# EAGLE board main (EAGLE 9.6.2), part 1 of 2
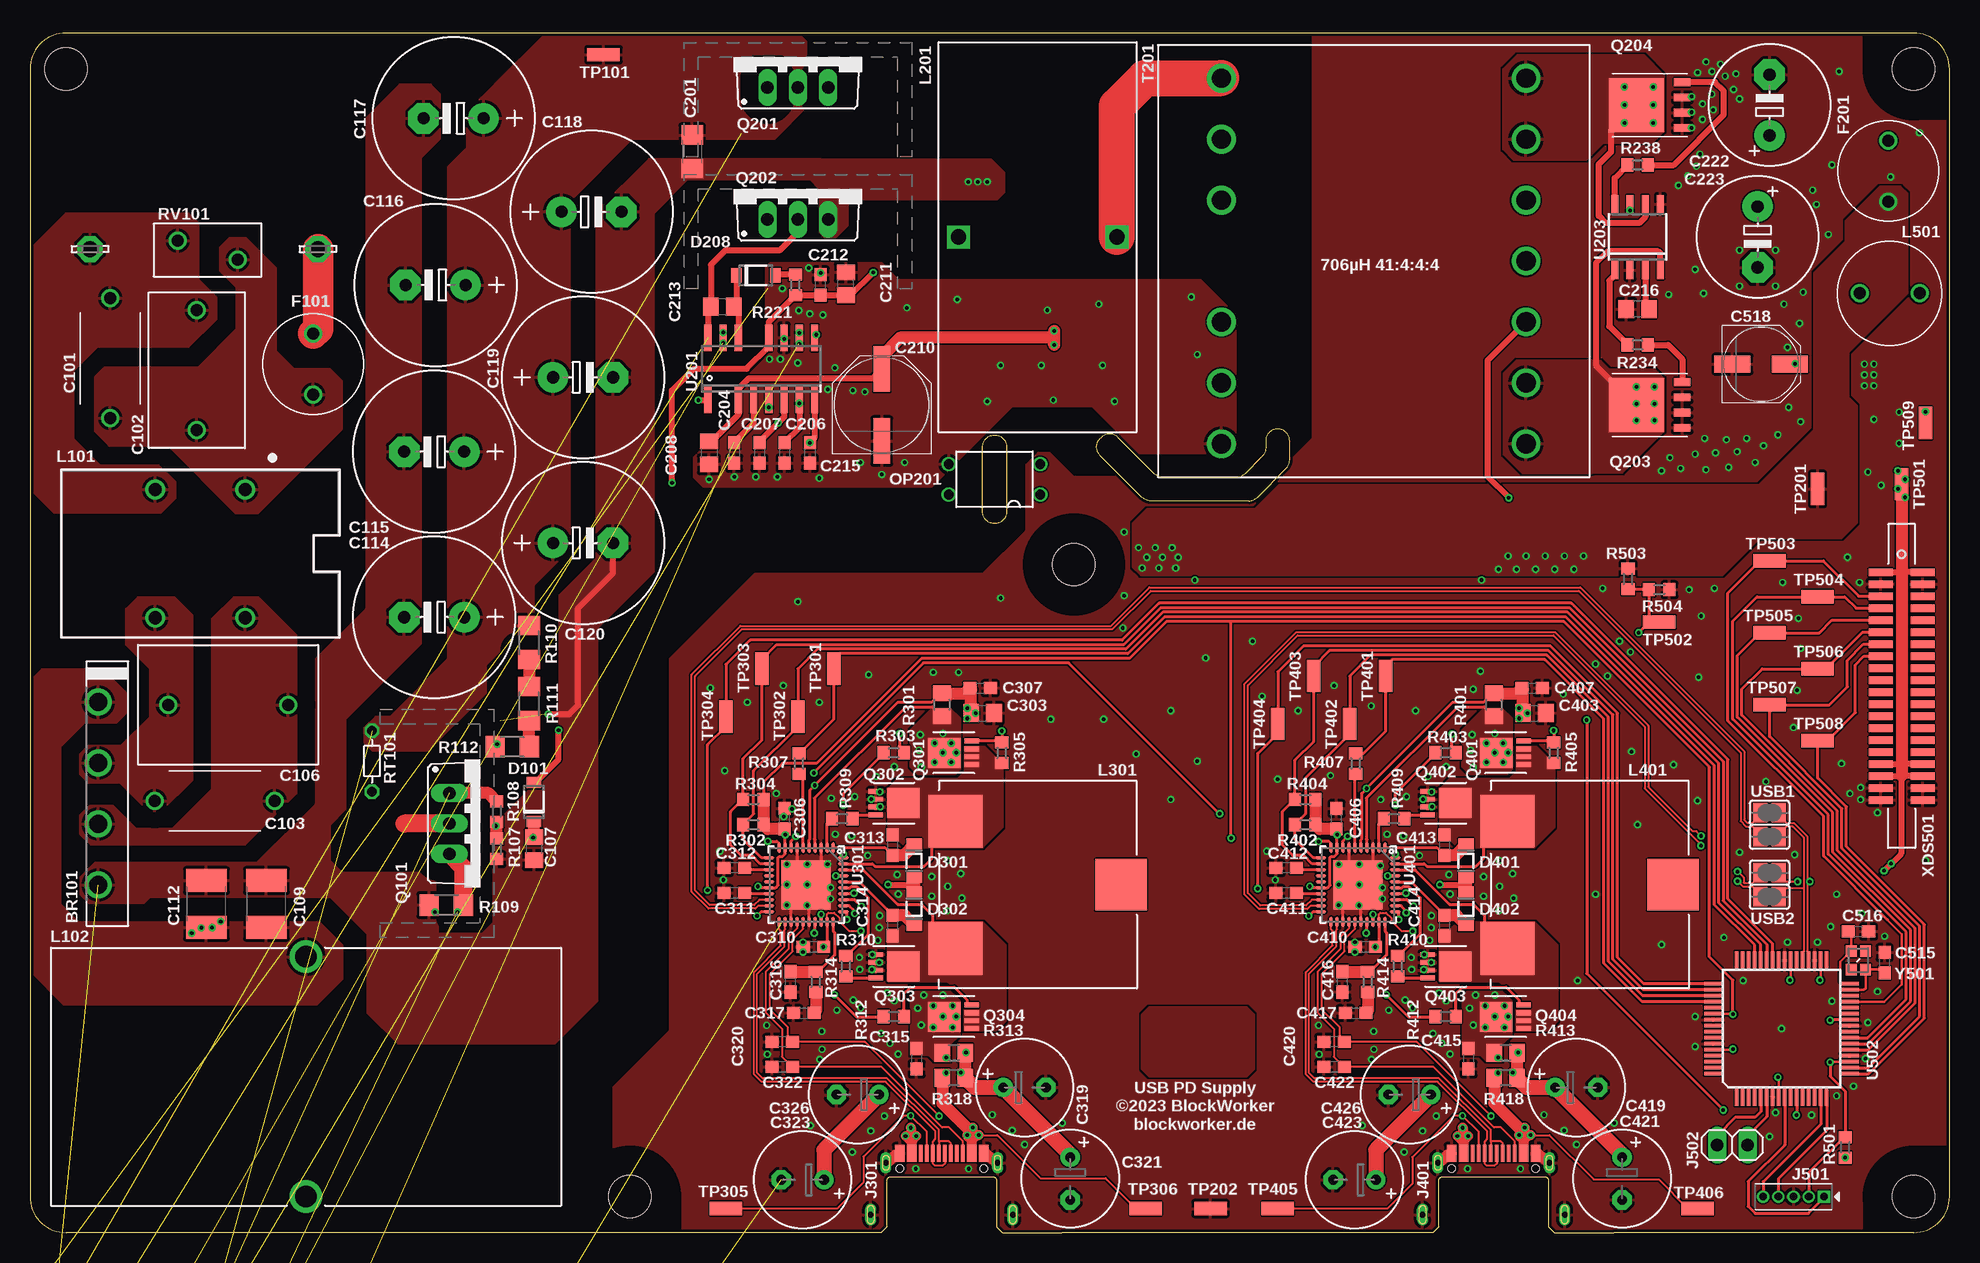
[diagram p5: board, top side]
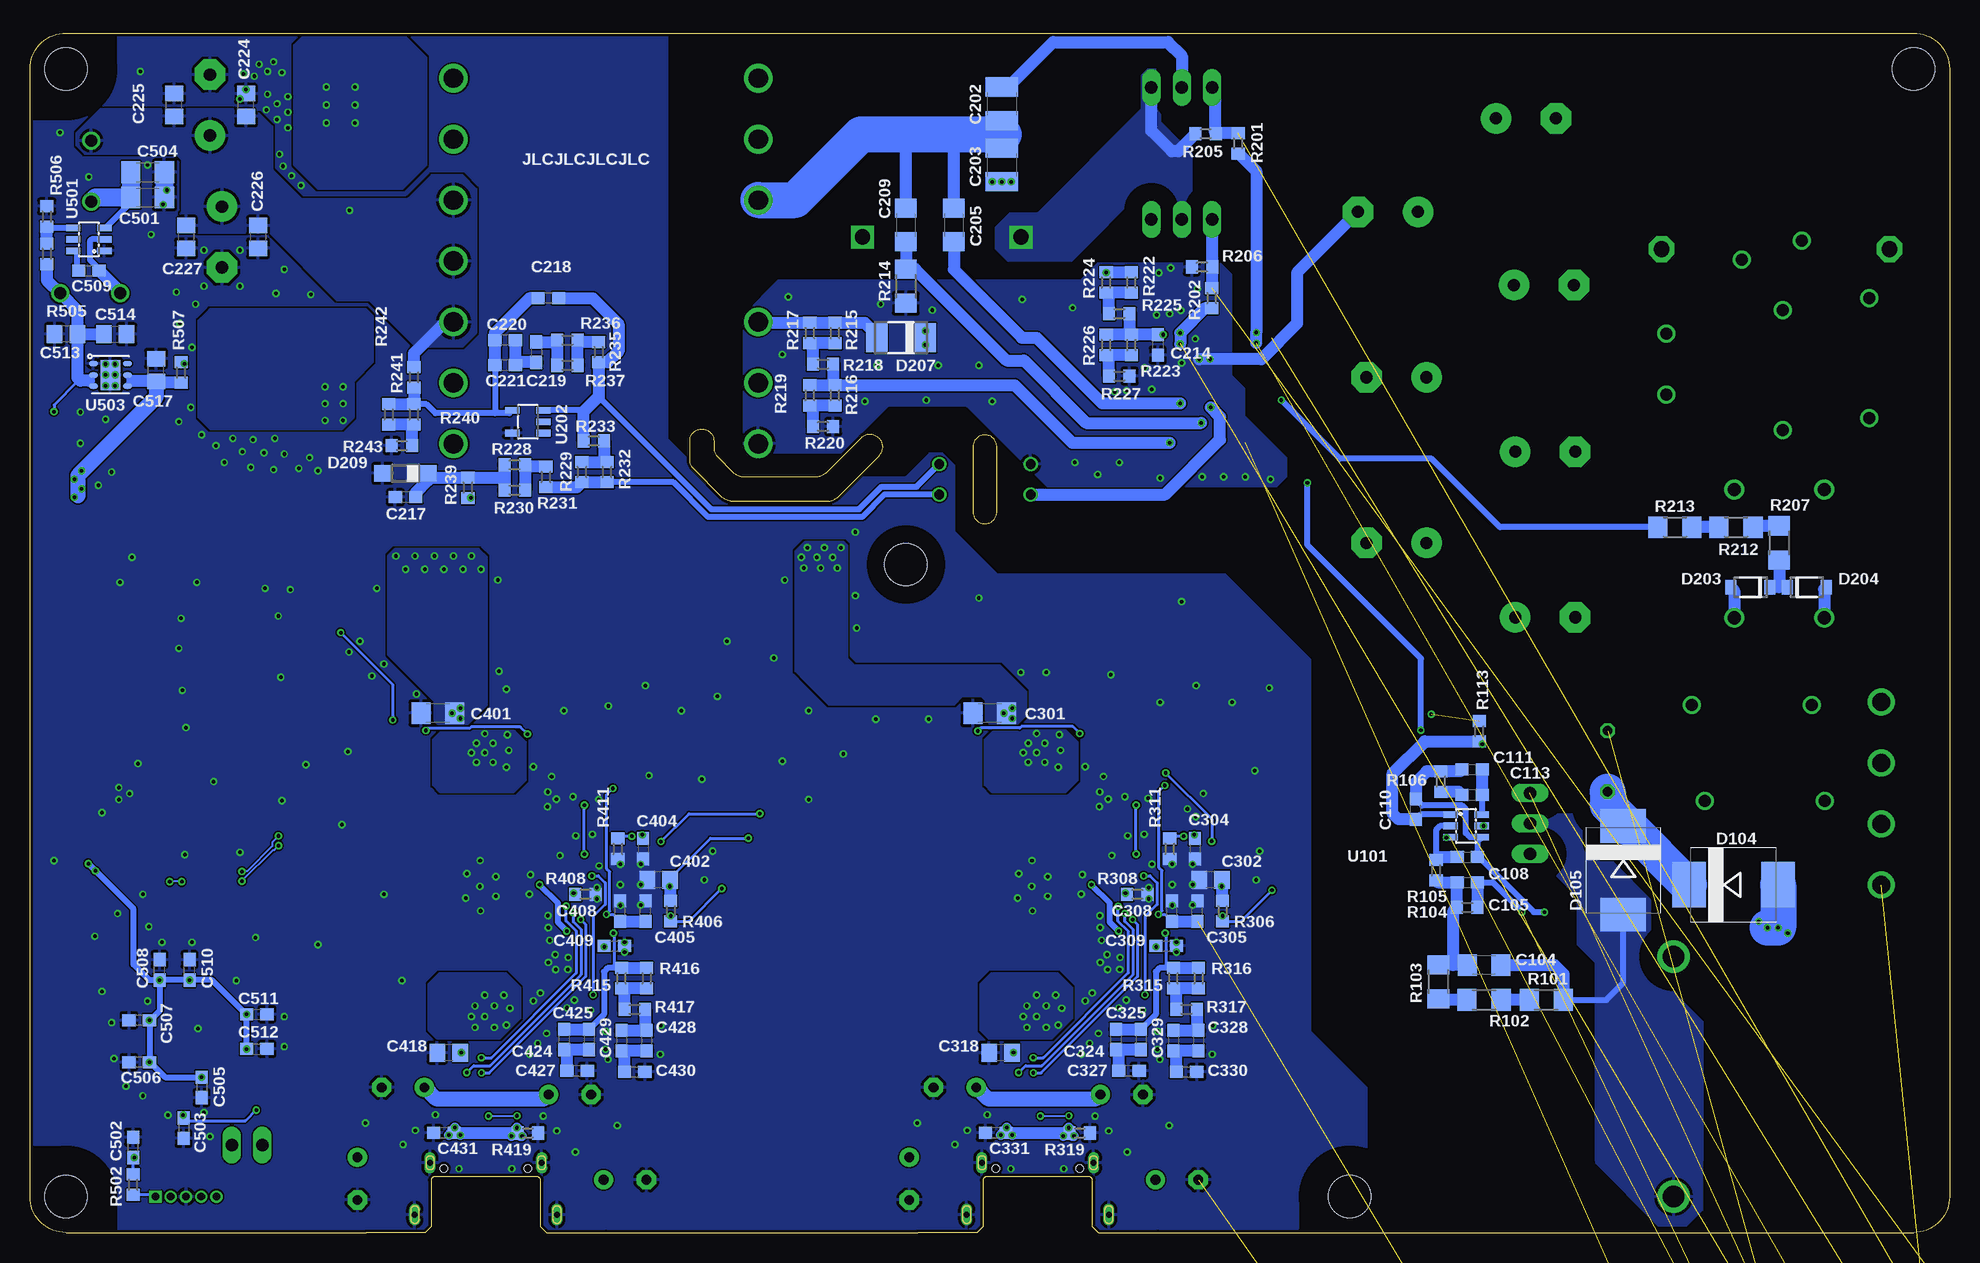
[diagram p6: board, bottom side, seen from below]

Size 160 x 100 mm. Coordinates in mm from the lower left corner, seen from the top.
Outline: 132,0 157,0 arc90 160,3 160,97 arc90 157,100 3,100 arc90 0,97 0,3 arc90 3,0 66,0
Outline: 112,0 86,0
Outline: 104,67 arc90 103,66 103,65.41 arc-45 102.71,64.71 101.29,63.29 arc-45 100.59,63 94.41,63 arc-45 93.71,63.29 90.71,66.29 arc90 89.29,66.29 89.21,66.21 arc90 89.21,64.79 92.71,61.29 arc45 93.41,61 101.59,61 arc45 102.29,61.29 104.71,63.71 arc45 105,64.41 105,66 arc90 104,67
Outline: 80.4,66.5 arc-90 81.4,65.5 81.4,60.1 arc-90 80.4,59.1 arc-90 79.4,60.1 79.4,65.5 arc-90 80.4,66.5
Copper layers (1*16): Top 0.035mm / dielectric 1.53mm / Bottom 0.035mm
Design rules "jlcpcb-2l": minimum track width 5mil, minimum drill 0.3mm, track to track 5mil, track to pad 5mil, pad to pad 5mil, via to via 5mil, smd to smd 0mil, copper to edge 0.25mm, drill to drill 0.5mm, minimum pad ring 0.15mm, minimum via ring 0.15mm, stop-mask expansion 4mil, vias tented up to drill 0.3mm, thermal gap 10mil
Net classes: 1 HV: clearance 4 mm to class 0; 2 primary: clearance 4 mm to class 0
Holes 3.5 mm at 87,55.7 50,3 3,97 157,97 157,3
tKeepout: area 0,85 to 28,100; area 83,51.7 to 91,59.7; area 46,-1 to 54,7; area -1,93 to 7,101; area 153,93 to 161,101; area 153,-1 to 161,7
tRestrict: area 85,53.7 to 89,57.7; area 48,1 to 52,5; area 1,95 to 5,99; area 155,95 to 159,99; area 155,1 to 159,5; area 0,95 to 5,100; area 155,95 to 160,100; area 155,0 to 160,5; area 48,0 to 52,5
bRestrict: area 85.5,54.2 to 88.5,57.2; area 48,1 to 52,5; area 1,95 to 5,99; area 155,95 to 159,99; area 155,1 to 159,5; area 0,95 to 5,100; area 48,0 to 52,5; area 155,0 to 160,5; area 155,95 to 160,100

## Footprints (pad centres in the part's own frame; a part is rotated, then mirrored left to right if it is on the bottom)
GBU6 = drill 1.5: 1 -7.62,0; 2 -2.54,0; 3 2.54,0; 4 7.62,0
C-10MM-TH = drill 1: 1 -5,0; 2 5,0
WCAP-FTX2-220N = drill 1: 1 -5,0; 2 5,0
C1206 = smd 1.6 x 1.8: 1 -1.4,0; 2 1.4,0
C0603 = smd 1.1 x 1: 1 -0.85,0; 2 0.85,0
WCAP-FTX2-470N = drill 1: 1 -5,0; 2 5,0
C0805 = smd 1.3 x 1.5: 1 -0.95,0; 2 0.95,0
C1812 = smd 1.9 x 3.4: 1 -1.95,0; 2 1.95,0
E5-12.5 = drill 1.016 pad 2.54: + -2.5,0 | drill 1.016 pad 2.54 octagon: - 2.5,0
C1210 = smd 1.6 x 2.7: 1 -1.4,0; 2 1.4,0
PANASONIC_E = smd 3.8 x 1.4: + 3,0; - -3,0
E5-10,5 = drill 1.016 pad 2.54: + -2.54,0 | drill 1.016 pad 2.54 octagon: - 2.54,0
E3,5-8 = drill 0.813 pad 1.6: + -1.778,0 | drill 0.813 pad 1.6 octagon: - 1.778,0
PANASONIC_D = smd 3 x 1.4: + 2.4,0; - -2.4,0
SOD123FL = smd 0.91 x 1.22: A 1.625,0; C -1.625,0
SOD123 = smd 1.4 x 1.4: A 1.9,0; C -1.9,0
SMC = smd 2.8 x 3.8: A 3.7,0; C -3.7,0
DO-214AC = smd 1.8 x 2.4: A 2.025,0; C -2.025,0
SOD323 = smd 1 x 1.3: 1 -1.35,0; 2 1.35,0
MRF_FUSE = drill 1: 1 -2.54,0; 2 2.54,0
12401948E412A = smd 0.8 x 1.4: A1B12 -3.5,6.6; A4B9 -2.5,6.6; B1A12 3.5,6.6; B4A9 2.5,6.6 | smd 0.3 x 1.4: A5 -1.25,6.6; A6 -0.25,6.6; A7 0.25,6.6; A8 1.25,6.6; B5 1.75,6.6; B6 0.75,6.6; B7 -0.75,6.6; B8 -1.75,6.6 | drill 0.5 pad 0.9 long: M1 -5.92,1.5; M2 5.92,1.5; M3 -4.65,5.82; M4 4.65,5.82 | hole 0.6: -3.5,5.35; 3.5,5.35
5PIN-1.27 = drill 0.65 pad 1.016 square: 1 -2.54,0 | drill 0.65 pad 1.016: 2 -1.27,0; 3 0,0; 4 1.27,0; 5 2.54,0
1X02 = drill 1.016 long: 1 -1.27,0; 2 1.27,0
WE-CMB_M = drill 1.1: 1 -3.75,-5.35; 2 3.75,-5.35; 3 3.75,5.35; 4 -3.75,5.35
ATCA-08 = drill 1.8: 1 0,10; 2 0,-10
HCTI-1MM = drill 1.27 square: 1 0,6.604; 2 0,-6.604
B82559B*A016 = smd 4.4 x 4.5: 1 -5.3,-6.85; 2 5.3,-6.85 | smd 4.3 x 4.3: M 0,6.95
RLB0912 = drill 1: 1 -2.5,0; 2 2.5,0
LSP13 = drill 1.321 pad 2.159 octagon: MP 0,0
DIP4 = drill 0.8: 1 -1.27,-3.81; 2 1.27,-3.81; 3 1.27,3.81; 4 -1.27,3.81
TO220BV-HS1 = drill 1.016 long: D 0,-2.54; G -2.54,-2.54; S 2.54,-2.54
POWERPAK-SO8 = smd 1.37 x 0.65: 1 -2.72,1.905; 2 -2.72,0.635; 3 -2.72,-0.635; 4 -2.72,-1.905 | smd 4.6 x 4.5: 5-8 1.105,0
TSDSON-8 = smd 1.2 x 0.4: 1 -1.5,0.975; 2 -1.5,0.325; 3 -1.5,-0.325; 4 -1.5,-0.975 | smd 2.7 x 2.5: 5-8 0.8,0
R1206 = smd 1.6 x 1.803: 1 -1.422,0; 2 1.422,0
R0603 = smd 1 x 1.1: 1 -0.85,0; 2 0.85,0
R0805 = smd 1.3 x 1.5: 1 -0.95,0; 2 0.95,0
R-5 = drill 0.813 octagon: 1 -2.54,0; 2 2.54,0
B72207S0271 = drill 1: 1 -2.5,0.8; 2 2.5,-0.8
SJ = smd 1.168 x 1.6: 1 -0.762,0; 2 0.762,0
ETD29/16/10-H = drill 1.6: 1 -15.24,-12.7; 2 -10.16,-12.7; 3 -5.08,-12.7; 5 5.08,-12.7; 6 10.16,-12.7; 7 15.24,-12.7; 8 15.24,12.7; 9 10.16,12.7; 10 5.08,12.7; 11 0,12.7; 12 -5.08,12.7; 13 -10.16,12.7; 14 -15.24,12.7
TP_0603_JOINED = smd 2.7 x 1.1: 1 0,0
SOT23-6L = smd 0.55 x 1.2: 1 -0.95,-1.3; 2 0,-1.3; 3 0.95,-1.3; 4 0.95,1.3; 5 0,1.3; 6 -0.95,1.3
SOIC16-NO2,13 = smd 0.6 x 2.2: 1 -4.445,-2.6; 3 -1.905,-2.6; 4 -0.635,-2.6; 5 0.635,-2.6; 6 1.905,-2.6; 7 3.175,-2.6; 8 4.445,-2.6; 9 4.445,2.6; 10 3.175,2.6; 11 1.905,2.6; 12 0.635,2.6; 14 -1.905,2.6; 15 -3.175,2.6; 16 -4.445,2.6
SOT23-5L = smd 0.55 x 1.2: 1 -0.95,-1.3; 2 0,-1.3; 3 0.95,-1.3; 4 0.95,1.3; 5 -0.95,1.3
SOIC8 = smd 0.6 x 1.5: 1 -1.905,-2.75; 2 -0.635,-2.75; 3 0.635,-2.75; 4 1.905,-2.75; 5 1.905,2.75; 6 0.635,2.75; 7 -0.635,2.75; 8 -1.905,2.75
TQFN-40 = smd 0.9 x 0.25: 1 -3.098,2.25; 2 -3.098,1.75; 3 -3.098,1.25; 4 -3.098,0.75; 5 -3.098,0.25; 6 -3.098,-0.25; 7 -3.098,-0.75; 8 -3.098,-1.25; 9 -3.098,-1.75; 10 -3.098,-2.25; 21 3.098,-2.25; 22 3.098,-1.75; 23 3.098,-1.25; 24 3.098,-0.75; 25 3.098,-0.25; 26 3.098,0.25; 27 3.098,0.75; 28 3.098,1.25; 29 3.098,1.75; 30 3.098,2.25 | smd 0.25 x 0.9: 11 -2.25,-3.098; 12 -1.75,-3.098; 13 -1.25,-3.098; 14 -0.75,-3.098; 15 -0.25,-3.098; 16 0.25,-3.098; 17 0.75,-3.098; 18 1.25,-3.098; 19 1.75,-3.098; 20 2.25,-3.098; 31 2.25,3.098; 32 1.75,3.098; 33 1.25,3.098; 34 0.75,3.098; 35 0.25,3.098; 36 -0.25,3.098; 37 -0.75,3.098; 38 -1.25,3.098; 39 -1.75,3.098; 40 -2.25,3.098 | smd 4.089 x 4.089: EP 0,0
TQFP64-10X10X1MM = smd 1.5 x 0.3: 1 -5.7,3.75; 2 -5.7,3.25; 3 -5.7,2.75; 4 -5.7,2.25; 5 -5.7,1.75; 6 -5.7,1.25; 7 -5.7,0.75; 8 -5.7,0.25; 9 -5.7,-0.25; 10 -5.7,-0.75; 11 -5.7,-1.25; 12 -5.7,-1.75; 13 -5.7,-2.25; 14 -5.7,-2.75; 15 -5.7,-3.25; 16 -5.7,-3.75; 33 5.7,-3.75; 34 5.7,-3.25; 35 5.7,-2.75; 36 5.7,-2.25; 37 5.7,-1.75; 38 5.7,-1.25; 39 5.7,-0.75; 40 5.7,-0.25; 41 5.7,0.25; 42 5.7,0.75; 43 5.7,1.25; 44 5.7,1.75; 45 5.7,2.25; 46 5.7,2.75; 47 5.7,3.25; 48 5.7,3.75 | smd 0.3 x 1.5: 17 -3.75,-5.7; 18 -3.25,-5.7; 19 -2.75,-5.7; 20 -2.25,-5.7; 21 -1.75,-5.7; 22 -1.25,-5.7; 23 -0.75,-5.7; 24 -0.25,-5.7; 25 0.25,-5.7; 26 0.75,-5.7; 27 1.25,-5.7; 28 1.75,-5.7; 29 2.25,-5.7; 30 2.75,-5.7; 31 3.25,-5.7; 32 3.75,-5.7; 49 3.75,5.7; 50 3.25,5.7; 51 2.75,5.7; 52 2.25,5.7; 53 1.75,5.7; 54 1.25,5.7; 55 0.75,5.7; 56 0.25,5.7; 57 -0.25,5.7; 58 -0.75,5.7; 59 -1.25,5.7; 60 -1.75,5.7; 61 -2.25,5.7; 62 -2.75,5.7; 63 -3.25,5.7; 64 -3.75,5.7
DFN6 = smd 0.45 x 0.725: 1 -0.95,-1.413; 2 0,-1.413; 3 0.95,-1.413; 4 0.95,1.413; 5 0,1.413; 6 -0.95,1.413 | smd 2.5 x 1.6: T 0,0
FFC3A20-20 = smd 0.6 x 2: A1 -9.5,1.75; A2 -8.5,1.75; A3 -7.5,1.75; A4 -6.5,1.75; A5 -5.5,1.75; A6 -4.5,1.75; A7 -3.5,1.75; A8 -2.5,1.75; A9 -1.5,1.75; A10 -0.5,1.75; A11 0.5,1.75; A12 1.5,1.75; A13 2.5,1.75; A14 3.5,1.75; A15 4.5,1.75; A16 5.5,1.75; A17 6.5,1.75; A18 7.5,1.75; A19 8.5,1.75; A20 9.5,1.75; B1 -9.5,-1.75; B2 -8.5,-1.75; B3 -7.5,-1.75; B4 -6.5,-1.75; B5 -5.5,-1.75; B6 -4.5,-1.75; B7 -3.5,-1.75; B8 -2.5,-1.75; B9 -1.5,-1.75; B10 -0.5,-1.75; B11 0.5,-1.75; B12 1.5,-1.75; B13 2.5,-1.75; B14 3.5,-1.75; B15 4.5,-1.75; B16 5.5,-1.75; B17 6.5,-1.75; B18 7.5,-1.75; B19 8.5,-1.75; B20 9.5,-1.75
XRCGB = smd 0.95 x 0.9: 1 -0.775,-0.6; 2 0.775,-0.6; 3 0.775,0.6; 4 -0.775,0.6

## Placement (x,y rotation side)
BR101  GBU6J  [GBU6]  5.7,36.6 90 top
C101  220pF  [C-10MM-TH]  6.7,72.9 90 top
C102  220nF  [WCAP-FTX2-220N]  13.9,71.9 90 top
C103  220pF  [C-10MM-TH]  15.4,36 180 top
C104  10pF 630V  [C1206]  38.8,22.3 180 bottom
C105  3.9nF  [C0603]  40.2,29.2 0 bottom
C106  470nF  [WCAP-FTX2-470N]  16.5,44 180 top
C107  10µF  [C0805]  42,32 270 top
C108  10pF  [C0603]  40.2,31.3 0 bottom
C109  220nF 630V  [C1812]  19.7,27.4 90 top
C110  1nF  [C0603]  44.5,35.3 90 bottom
C111  47nF  [C0603]  39.8,38.6 0 bottom
C112  220nF 630V  [C1812]  14.7,27.4 90 top
C113  330nF  [C0603]  39.8,36.5 0 bottom
C114  22µF  [E5-12.5]  33.7,51.3 180 top
C115  22µF  [E5-12.5]  33.7,65.1 180 top
C116  22µF  [E5-12.5]  33.8,79 180 top
C117  22µF  [E5-12.5]  35.3,92.9 180 top
C118  22µF  [E5-12.5]  46.8,85.1 0 top
C119  22µF  [E5-12.5]  46.1,71.3 0 top
C120  22µF  [E5-12.5]  46.1,57.5 0 top
C201  100nF 450V  [C1206]  55.2,90.1 270 top
C202  12nF 630V  [C1210]  79,94.1 270 bottom
C203  12nF 630V  [C1210]  79,89 270 bottom
C204  1nF  [C0603]  58.7,65 270 top
C205  82pF 630V  [C1206]  83,84 270 bottom
C206  7.5nF  [C0603]  62.9,65 270 top
C207  3.3pF  [C0603]  60.8,65 270 top
C208  2.2µF  [C0805]  56.6,65 270 top
C209  150pF 630V  [C1206]  87,84 270 bottom
C210  150µF 35V  [PANASONIC_E]  71,69 90 top
C211  22µF  [C0805]  68,79.1 90 top
C212  100nF  [C0603]  65.9,79 90 top
C213  3.3µF  [C0805]  57.7,77.2 0 top
C214  1µF  [C0603]  66,74 270 bottom
C215  7pF  [C0603]  65,65 270 top
C216  2.2µF  [C0805]  134,77 180 top
C217  0µF  [C0603]  128.7,61.3 180 bottom
C218  0pF  [C0603]  116.8,77.9 180 bottom
C219  ?nF  [C0603]  117.8,73.4 270 bottom
C220  0nF  [C0603]  120.4,74.4 180 bottom
C221  22nF  [C0603]  120.4,72.3 180 bottom
C222  820µF 25V  [E5-10,5]  145,94 90 top
C223  820µF 25V  [E5-10,5]  144,83 270 top
C224  22µF  [C0805]  142,94 90 bottom
C225  22µF  [C0805]  148,94 90 bottom
C226  22µF  [C0805]  141,83 270 bottom
C227  22µF  [C0805]  147,83 270 bottom
C301  33µF  [C1206]  80,43.3 180 bottom
C302  10µF  [C0805]  61.6,29.4 180 bottom
C303  10µF  [C0805]  79.4,43.3 0 top
C304  100nF  [C0603]  62.9,32 270 bottom
C305  1µF  [C0603]  62.7,26.8 90 bottom
C306  10nF  [C0603]  62.9,34.5 90 top
C307  100nF  [C0603]  79.2,45.4 0 top
C308  100nF  [C0603]  64.8,26.8 90 bottom
C309  4.7µF  [C0603]  65.3,23.9 0 bottom
C310  100nF  [C0603]  65.3,23.8 180 top
C311  1µF  [C0603]  58.7,28.3 180 top
C312  1µF  [C0603]  58.7,30.4 180 top
C313  100nF  [C0603]  71.9,32.3 270 top
C314  100nF  [C0603]  71.9,25.6 270 top
C315  100nF  [C0603]  73.9,14.5 270 top
C316  33nF  [C0603]  63.4,20.9 90 top
C317  470nF  [C0603]  64.5,18.3 0 top
C318  10µF  [C0805]  79.1,15 180 bottom
C319  82µF  [E3,5-8]  82.9,12.1 0 top
C320  270pF  [C0603]  62.7,15.9 180 top
C321  82µF  [E3,5-8]  86.7,4.5 270 top
C322  270pF  [C0603]  62.7,13.8 180 top
C323  82µF  [E3,5-8]  64.4,4.4 180 top
C324  0pF  [C0603]  69.5,16.1 270 bottom
C325  18pF  [C0603]  67.4,16.1 270 bottom
C326  82µF  [E3,5-8]  69,11.5 180 top
C327  ?pF  [C0603]  68.4,13.5 0 bottom
C328  0nF  [C0603]  62.6,16 270 bottom
C329  1.2nF  [C0603]  64.7,16 270 bottom
C330  ?nF  [C0603]  63.6,13.4 0 bottom
C331  100nF  [C0603]  79.5,8.3 180 bottom
C401  33µF  [C1206]  126,43.3 180 bottom
C402  10µF  [C0805]  107.6,29.4 180 bottom
C403  10µF  [C0805]  125.4,43.3 0 top
C404  100nF  [C0603]  108.9,32 270 bottom
C405  1µF  [C0603]  108.7,26.8 90 bottom
C406  10nF  [C0603]  108.9,34.5 90 top
C407  100nF  [C0603]  125.2,45.4 0 top
C408  100nF  [C0603]  110.8,26.8 90 bottom
C409  4.7µF  [C0603]  111.3,23.9 0 bottom
C410  100nF  [C0603]  111.3,23.8 180 top
C411  1µF  [C0603]  104.7,28.3 180 top
C412  1µF  [C0603]  104.7,30.4 180 top
C413  100nF  [C0603]  117.9,32.3 270 top
C414  100nF  [C0603]  117.9,25.6 270 top
C415  100nF  [C0603]  119.9,14.5 270 top
C416  33nF  [C0603]  109.4,20.9 90 top
C417  470nF  [C0603]  110.5,18.3 0 top
C418  10µF  [C0805]  125.1,15 180 bottom
C419  82µF  [E3,5-8]  128.9,12.1 0 top
C420  270pF  [C0603]  108.7,15.9 180 top
C421  82µF  [E3,5-8]  132.7,4.5 270 top
C422  270pF  [C0603]  108.7,13.8 180 top
C423  82µF  [E3,5-8]  110.4,4.4 180 top
C424  0pF  [C0603]  115.5,16.1 270 bottom
C425  18pF  [C0603]  113.4,16.1 270 bottom
C426  82µF  [E3,5-8]  115,11.5 180 top
C427  ?pF  [C0603]  114.4,13.5 0 bottom
C428  0nF  [C0603]  108.6,16 270 bottom
C429  1.2nF  [C0603]  110.7,16 270 bottom
C430  ?nF  [C0603]  109.6,13.4 0 bottom
C431  100nF  [C0603]  125.5,8.3 180 bottom
C501  10µF 35V  [C1206]  150.2,86.3 0 bottom
C502  100nF  [C0603]  151.4,7.1 90 bottom
C503  100nF  [C0603]  147.2,8.7 270 bottom
C504  10µF 35V  [C1206]  150.2,88.4 0 bottom
C505  100nF  [C0603]  145.7,12.1 270 bottom
C506  100nF  [C0603]  150.9,14.2 180 bottom
C507  100nF  [C0603]  150.9,17.7 180 bottom
C508  100nF  [C0603]  149.2,21.9 90 bottom
C509  100nF  [C0603]  155.1,80.2 0 bottom
C510  100nF  [C0603]  146.7,21.9 90 bottom
C511  100nF  [C0603]  141.1,18.2 0 bottom
C512  100nF  [C0603]  141.1,15.3 0 bottom
C513  22µF  [C0805]  157,74.9 180 bottom
C514  22µF  [C0805]  152.9,74.9 0 bottom
C515  7pF  [C0603]  154.6,22.5 90 top
C516  7pF  [C0603]  152.4,25.1 0 top
C517  2.2µF  [C0805]  149.5,71.9 90 bottom
C518  330µF  [PANASONIC_D]  144.3,72.4 0 top
D101  GS1006FL  [SOD123FL]  42,35.9 90 top
D102  15V  [SOD123]  0,-50 0 top  (outside the outline)
D103  18V  [SOD123]  0,-44 0 top  (outside the outline)
D104  S3J  [SMC]  18,29 0 bottom
D105  S3J  [SMC]  27.2,30.2 270 bottom
D201  GS1006FL  [SOD123FL]  -1,-31 0 top  (outside the outline)
D202  GS1006FL  [SOD123FL]  -1,-38 0 top  (outside the outline)
D203  GS1006FL  [SOD123FL]  16.6,53.8 180 bottom
D204  GS1006FL  [SOD123FL]  11.9,53.8 0 bottom
D205  18V  [SOD123]  0,-14 0 top  (outside the outline)
D206  18V  [SOD123]  0,-8 0 top  (outside the outline)
D207  SS16  [DO-214AC]  87.4,74.6 180 bottom
D208  GS1006FL  [SOD123FL]  60.5,79.8 0 top
D209  15V  [SOD123]  128.7,63.3 180 bottom
D210  20V  [SOD123]  0,-82 0 top  (outside the outline)
D301  SS0840WS  [SOD323]  73.7,31 270 top
D302  SS0840WS  [SOD323]  73.7,27 90 top
D401  SS0840WS  [SOD323]  119.7,31 270 top
D402  SS0840WS  [SOD323]  119.7,27 90 top
F101  3A  [MRF_FUSE]  23.6,72.4 270 top
F201  10A  [MRF_FUSE]  154.9,88.5 270 top
J301  12401948E412A  [12401948E412A]  76,0 0 top
J401  12401948E412A  [12401948E412A]  122,0 0 top
J501  ICSP  [5PIN-1.27]  147,3 180 top
J502  UART  [1X02]  141.9,7.3 180 top
L101  10mH  [WE-CMB_M]  14.2,56.6 180 top
L102  250µH  [ATCA-08]  23,13 0 top
L201  100µH  [HCTI-1MM]  84,83 90 top
L301  4.7µH  [B82559B*A016]  84,29 270 top
L401  4.7µH  [B82559B*A016]  130,29 270 top
L501  10µH  [RLB0912]  155,78.3 0 top
LSP101  AC_L  [LSP13]  24,82 0 top
LSP102  AC_N  [LSP13]  5,82 0 top
OP201  FOD817A  [DIP4]  80.4,62.8 90 top
Q101  IPP65R095C7  [TO220BV-HS1]  37.5,34.1 270 top
Q201  IPP65R155CFD7  [TO220BV-HS1]  64,98 0 top
Q202  IPP65R155CFD7  [TO220BV-HS1]  64,87 0 top
Q203  SiR182DP  [POWERPAK-SO8]  135,69 180 top
Q204  SiR182DP  [POWERPAK-SO8]  135,94 180 top
Q301  ISZ0702NLS  [TSDSON-8]  77,40 180 top
Q302  ISZ0702NLS  [TSDSON-8]  72,35.8 0 top
Q303  ISZ0702NLS  [TSDSON-8]  72,22.2 0 top
Q304  ISZ0702NLS  [TSDSON-8]  77,18 180 top
Q401  ISZ0702NLS  [TSDSON-8]  123,40 180 top
Q402  ISZ0702NLS  [TSDSON-8]  118,35.8 0 top
Q403  ISZ0702NLS  [TSDSON-8]  118,22.2 0 top
Q404  ISZ0702NLS  [TSDSON-8]  123,18 180 top
R101  4.99MΩ  [R1206]  33.6,19.4 0 bottom
R102  4.99MΩ  [R1206]  38.8,19.4 0 bottom
R103  4.99MΩ  [R1206]  42.6,20.9 270 bottom
R104  36.5kΩ  [R0603]  40.2,27.1 180 bottom
R105  3kΩ  [R0603]  42.8,30.2 90 bottom
R106  200kΩ  [R0603]  42.4,37.6 270 bottom
R107  82kΩ  [R0603]  38.9,32 90 top
R108  10Ω  [R0603]  38.9,35.1 90 top
R109  60mΩ  [R1206]  34.7,27.3 0 top
R110  3MΩ  [R1206]  41.6,49.2 90 top
R111  3MΩ  [R1206]  41.6,44.1 90 top
R112  3MΩ  [R1206]  40.2,40.5 0 top
R113  62kΩ  [R0603]  39.2,41.8 270 bottom
R201  47Ω  [R0603]  59.3,90.8 90 bottom
R202  47Ω  [R0603]  61.5,77.9 90 bottom
R203  1Ω  [R0603]  -1,-25 0 top  (outside the outline)
R204  1Ω  [R0603]  -1,-20 0 top  (outside the outline)
R205  4.7kΩ  [R0603]  62,91.6 0 bottom
R206  4.7kΩ  [R0603]  62.3,80.5 0 bottom
R207  1.69kΩ  [R1206]  14.2,57.5 90 bottom
R208  4.99MΩ  [R1206]  0,-56 0 top  (outside the outline)
R209  4.99MΩ  [R1206]  0,-63 0 top  (outside the outline)
R210  4.99MΩ  [R1206]  0,-70 0 top  (outside the outline)
R211  44.2kΩ  [R0603]  -1,-76 0 top  (outside the outline)
R212  1.69kΩ  [R1206]  17.8,58.8 180 bottom
R213  1.69kΩ  [R1206]  22.9,58.8 180 bottom
R214  100Ω  [R1206]  87,78.9 90 bottom
R215  ?Ω  [R0603]  92.9,75 90 bottom
R216  ?Ω  [R0603]  92.9,69.8 90 bottom
R217  30kΩ  [R0603]  95,75 90 bottom
R218  0Ω  [R0603]  93.9,72.4 180 bottom
R219  5.36kΩ  [R0603]  95,69.8 90 bottom
R220  0Ω  [R0603]  93.9,67.2 180 bottom
R221  1Ω  [R0603]  63.8,79 270 top
R222  ?Ω  [R0603]  68.2,79.2 90 bottom
R223  ?Ω  [R0603]  68.2,74 90 bottom
R224  390kΩ  [R0603]  70.3,79.2 90 bottom
R225  0Ω  [R0603]  69.2,76.6 180 bottom
R226  866kΩ  [R0603]  70.3,74 90 bottom
R227  0Ω  [R0603]  69.2,71.4 180 bottom
R228  ?Ω  [R0603]  119.6,64 180 bottom
R229  ?Ω  [R0603]  114,63.4 270 bottom
R230  1kΩ  [R0603]  119.6,61.9 180 bottom
R231  0Ω  [R0603]  117,63 90 bottom
R232  1kΩ  [R0603]  111.9,63.4 270 bottom
R233  0Ω  [R0603]  113,66 0 bottom
R234  0Ω  [R0603]  134,74 180 top
R235  0Ω  [R0603]  112.6,73.4 90 bottom
R236  ?Ω  [R0603]  115.2,74.4 180 bottom
R237  100Ω  [R0603]  115.2,72.3 180 bottom
R238  0Ω  [R0603]  134,89 0 top
R239  1kΩ  [R0603]  123.5,62.1 270 bottom
R240  470kΩ  [R0603]  128,68.2 90 bottom
R241  100kΩ  [R0603]  128,71.3 90 bottom
R242  7.5kΩ  [R0603]  130.1,68.2 90 bottom
R243  0Ω  [R0603]  129,65.6 0 bottom
R301  5mΩ  [R0805]  76,44 270 top
R302  4.7kΩ  [R0603]  60.3,34 180 top
R303  0Ω  [R0603]  72,40 0 top
R304  4.7kΩ  [R0603]  60.3,36.1 180 top
R305  2.2kΩ  [R0603]  81,40 270 top
R306  100kΩ  [R0603]  60.6,26.8 270 bottom
R307  1kΩ  [R0603]  64.1,39.1 270 top
R308  0Ω  [R0603]  67.7,28.2 180 bottom
R309  0Ω  [R0603]  67.7,34.5 0 top
R310  0Ω  [R0603]  68,22.2 270 top
R311  1MΩ  [R0603]  65,32 270 bottom
R312  0Ω  [R0603]  72,18 0 top
R313  3mΩ  [R0805]  77,15 0 top
R314  499Ω  [R0603]  65.5,20.9 270 top
R315  ?Ω  [R0603]  64.7,21.2 270 bottom
R316  62kΩ  [R0603]  62.6,21.2 270 bottom
R317  0Ω  [R0603]  63.6,18.6 0 bottom
R318  5mΩ  [R0805]  77,12.9 180 top
R319  100kΩ?  [R0603]  72.5,8.3 180 bottom
R401  5mΩ  [R0805]  122,44 270 top
R402  4.7kΩ  [R0603]  106.3,34 180 top
R403  0Ω  [R0603]  118,40 0 top
R404  4.7kΩ  [R0603]  106.3,36.1 180 top
R405  2.2kΩ  [R0603]  127,40 270 top
R406  100kΩ  [R0603]  106.6,26.8 270 bottom
R407  1kΩ  [R0603]  110.5,39.1 270 top
R408  0Ω  [R0603]  113.7,28.2 180 bottom
R409  0Ω  [R0603]  113.7,34.5 0 top
R410  0Ω  [R0603]  114,22.2 270 top
R411  1MΩ  [R0603]  111,32 270 bottom
R412  0Ω  [R0603]  118,18 0 top
R413  3mΩ  [R0805]  123,15 0 top
R414  499Ω  [R0603]  111.5,20.9 270 top
R415  ?Ω  [R0603]  110.7,21.2 270 bottom
R416  62kΩ  [R0603]  108.6,21.2 270 bottom
R417  0Ω  [R0603]  109.6,18.6 0 bottom
R418  5mΩ  [R0805]  123,12.9 180 top
R419  100kΩ?  [R0603]  118.5,8.3 180 bottom
R501  10kΩ  [R0603]  151.3,7.1 90 top
R502  1kΩ  [R0603]  151.4,4 90 bottom
R503  100kΩ  [R0603]  133.2,54.5 90 top
R504  8.2kΩ  [R0603]  135.8,53.6 180 top
R505  100kΩ  [R0603]  158.6,81.6 270 bottom
R506  20kΩ  [R0603]  158.6,84.7 270 bottom
R507  0Ω  [R0603]  147.4,71.7 270 bottom
RT101  4.7Ω?  [R-5]  28.5,39.3 270 top
RV101  275V  [B72207S0271]  14.8,81.9 180 top
SJ501  [SJ]  145,33 180 top
SJ502  [SJ]  145,35 180 top
SJ503  [SJ]  145,28 180 top
SJ504  [SJ]  145,30 180 top
T201  706µH 41:4:4:4  [ETD29/16/10-H]  112,81 270 top
TP101  RCU-0(J)  [TP_0603_JOINED]  47.8,98.2 180 top
TP201  RCU-0(J)  [TP_0603_JOINED]  149,62 90 top
TP202  RCU-0(J)  [TP_0603_JOINED]  98.4,2 0 top
TP301  RCU-0(J)  [TP_0603_JOINED]  67,47 90 top
TP302  RCU-0(J)  [TP_0603_JOINED]  64,43 90 top
TP303  RCU-0(J)  [TP_0603_JOINED]  61,47 90 top
TP304  RCU-0(J)  [TP_0603_JOINED]  58,43 90 top
TP305  RCU-0(J)  [TP_0603_JOINED]  58,2 0 top
TP306  RCU-0(J)  [TP_0603_JOINED]  93,2 0 top
TP401  RCU-0(J)  [TP_0603_JOINED]  113,46.4 90 top
TP402  RCU-0(J)  [TP_0603_JOINED]  110,42.4 90 top
TP403  RCU-0(J)  [TP_0603_JOINED]  107,46.4 90 top
TP404  RCU-0(J)  [TP_0603_JOINED]  104,42.4 90 top
TP405  RCU-0(J)  [TP_0603_JOINED]  104,2 0 top
TP406  RCU-0(J)  [TP_0603_JOINED]  139,2 0 top
TP501  RCU-0(J)  [TP_0603_JOINED]  156,62.4 90 top
TP502  RCU-0(J)  [TP_0603_JOINED]  135.8,50.9 0 top
TP503  RCU-0(J)  [TP_0603_JOINED]  145,56 0 top
TP504  RCU-0(J)  [TP_0603_JOINED]  149,53 0 top
TP505  RCU-0(J)  [TP_0603_JOINED]  145,50 0 top
TP506  RCU-0(J)  [TP_0603_JOINED]  149,47 0 top
TP507  RCU-0(J)  [TP_0603_JOINED]  145,44 0 top
TP508  RCU-0(J)  [TP_0603_JOINED]  149,41 0 top
TP509  RCU-0(J)  [TP_0603_JOINED]  158,67.5 90 top
U101  UCC28056B  [SOT23-6L]  40.3,33.9 270 bottom
U201  UCC256404  [SOIC16-NO2,13]  60.95,72 0 top
U202  TLV431E5  [SOT23-5L]  118.5,67.6 90 bottom
U203  UCC24624  [SOIC8]  134,83 0 top
U301  MAX25432  [TQFN-40]  64.7,29 270 top
U401  MAX25432  [TQFN-40]  110.7,29 270 top
U501  TPS54308  [SOT23-6L]  155.1,82.8 90 bottom
U502  PIC32MZ-EF-064  [TQFP64-10X10X1MM]  146,17 90 top
U503  LD39150DT33  [DFN6]  153.3,71.5 270 bottom
XDS501  NHD-3.5-320240FT-FPCV  [FFC3A20-20]  156,45.55 270 top
Y501  24MHz  [XRCGB]  152.4,22.7 90 top